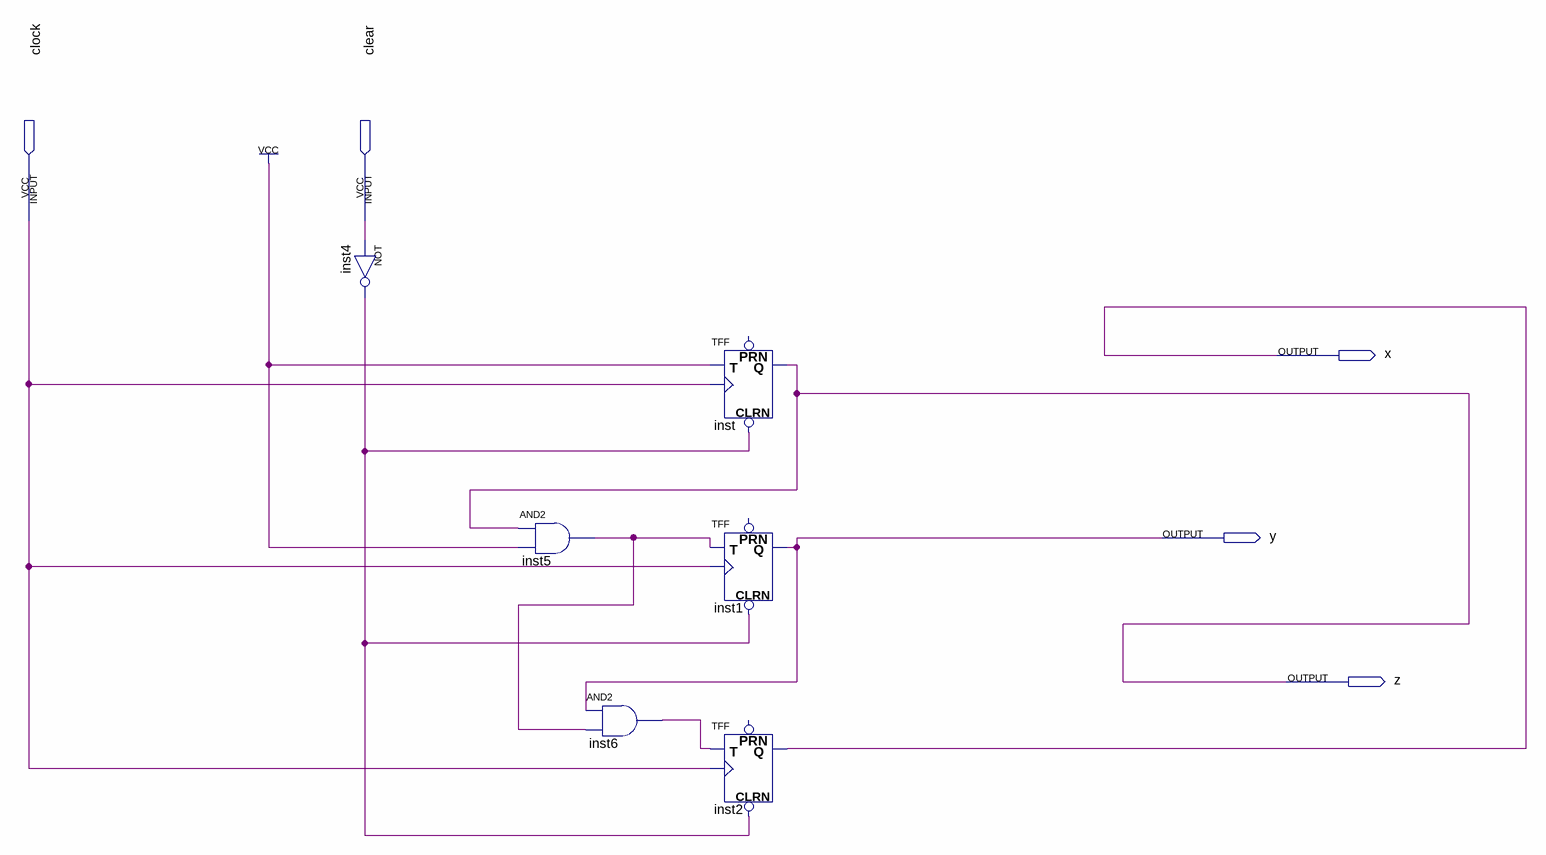
[diagram p0: schematic sheet]
// Quartus schematic cont.bdf as structural Verilog: 6 symbols, 5 pins
module cont (
  input  clock,
  input  clear,
  output x,
  output y,
  output z
);

  wire inst4_out, inst5_out, inst6_out;

  not inst4 (inst4_out, clear);
  and inst5 (inst5_out, z, 1'b1);
  and inst6 (inst6_out, y, inst5_out);
  TFF inst (.CLRN(inst4_out), .T(1'b1), .CLK(clock), .Q(z));  // open: PRN
  TFF inst1 (.CLRN(inst4_out), .T(inst5_out), .CLK(clock), .Q(y));  // open: PRN
  TFF inst2 (.CLRN(inst4_out), .T(inst6_out), .CLK(clock), .Q(x));  // open: PRN
endmodule
